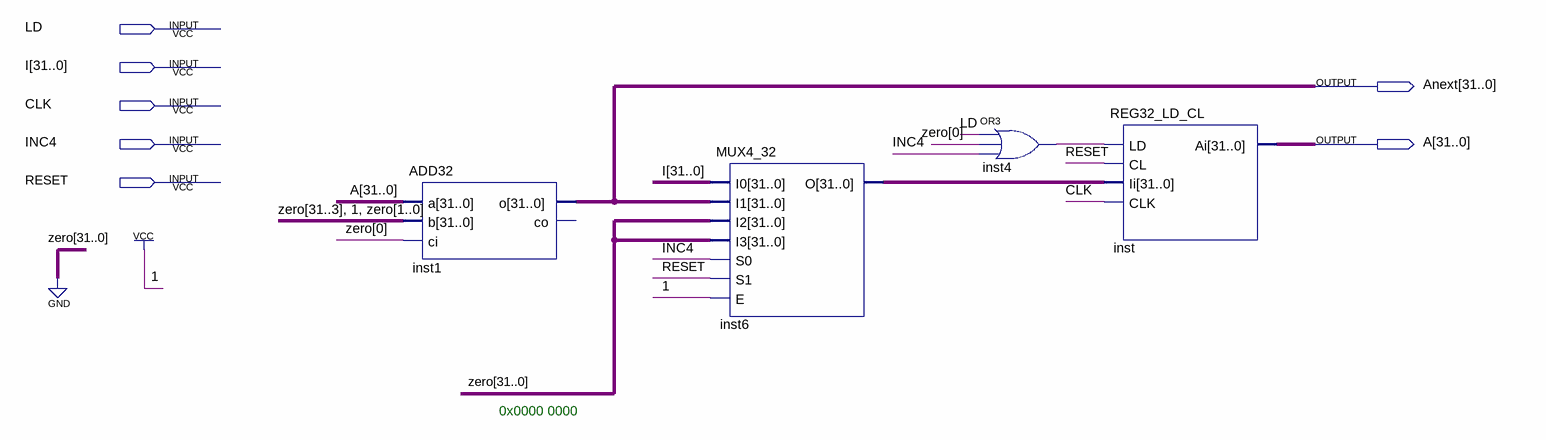
[diagram p0: schematic sheet]
// Quartus schematic PC.bdf as structural Verilog: 4 symbols, 7 pins
module PC (
  input  LD,
  input  [31:0] I,
  input  CLK,
  input  INC4,
  input  RESET,
  output [31:0] Anext,
  output [31:0] A
);

  wire inst4_out;
  wire [31:0] inst6_o;

  ADD32 inst1 (.a(A), .b(32'b00000000000000000000000000000100), .ci(1'b0), .o(Anext));  // open: co
  MUX4_32 inst6 (.I0(I), .I1(Anext), .I2({32{1'b0}}), .I3({32{1'b0}}), .S0(INC4), .S1(RESET), .E(1'b1), .O(inst6_o));
  or inst4 (inst4_out, LD, 1'b0, INC4);
  REG32_LD_CL inst (.LD(inst4_out), .CL(RESET), .Ii(inst6_o), .CLK(CLK), .Ai(A));

  // Notes on the sheet:
  //   0x0000 0000
endmodule
